# EAGLE design clogic (EAGLE 5.11)

## Sheet 1 of 2
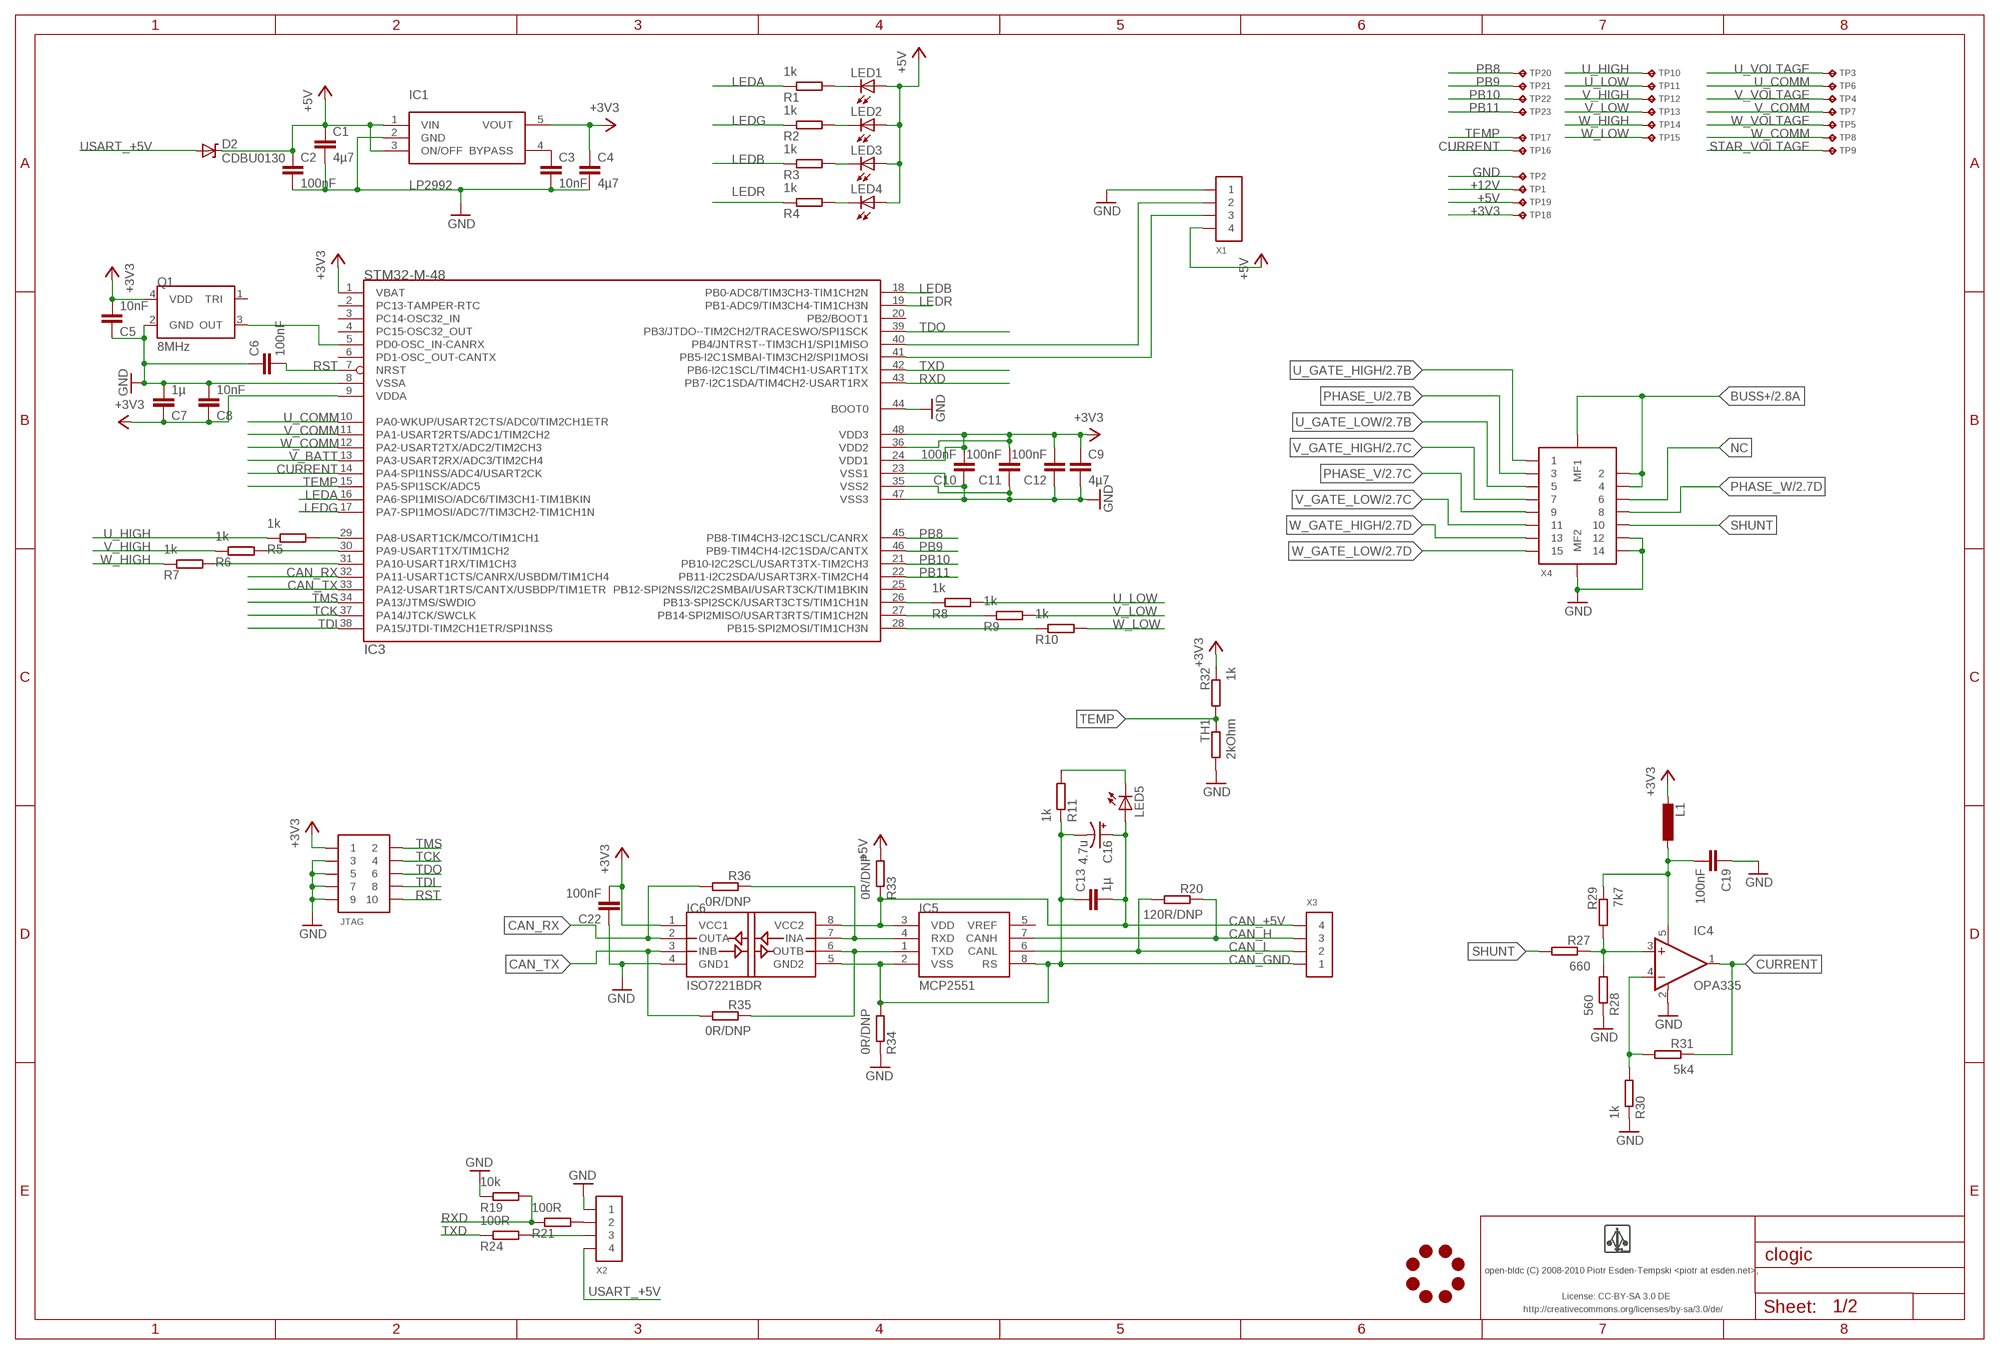
[diagram p0: schematic, sheet 1]

### Parts
C1  4µ7  CAPACITOR-0603  [0603-CAP]
C2  100nF  CAPACITOR-0603  [0603-CAP]
C3  10nF  CAPACITOR-0603  [0603-CAP]
C4  4µ7  CAPACITOR-0603  [0603-CAP]
C5  10nF  CAPACITOR-0603  [0603-CAP]
C6  100nF  CAPACITOR-0603  [0603-CAP]
C7  1µ  CAPACITOR-0603  [0603-CAP]
C8  10nF  CAPACITOR-0603  [0603-CAP]
C9  4µ7  CAPACITOR-0603  [0603-CAP]
C10  100nF  CAPACITOR-0603  [0603-CAP]
C11  100nF  CAPACITOR-0603  [0603-CAP]
C12  100nF  CAPACITOR-0603  [0603-CAP]
C13  1µ  CAPACITOR-0603  [0603-CAP]
C16  4.7u  CPOL-US  [CAP_0805TANT_F95]
C19  100nF  CAPACITOR-0603  [0603-CAP]
C22  100nF  CAPACITOR-0603  [0603-CAP]
D2  CDBU0130  DIODE-ZENER-0603  [0603-LED]
IC1  LP2992  [SOT23-5]
IC3  STM32-M-48  [LQFP48]
IC4  OPA335  [SOT23-5]
IC5  MCP2551  [SO8]
IC6  ISO7221BDR  ISO7221  [SO8]
JL1  JOBY_LOGO-6MIL  [JOBY_LOGO_6MIL]
JTAG  CONN_5-2-FTSH-V  [FTSH-105-DV]
L1  INDUCTOR-0603  [0603-IND]
LED1  AMBER  LED-0603  [0603-LED]
LED2  GREEN  LED-0603  [0603-LED]
LED3  BLUE  LED-0603  [0603-LED]
LED4  RED  LED-0603  [0603-LED]
LED5  WHITE  LED-0603  [0603-LED]
Q1  8MHz  ASE_ASCILLATOR  [ASE_OSCILLATOR]
R1  1k  RESISTOR-0603  [0603-RES]
R2  1k  RESISTOR-0603  [0603-RES]
R3  1k  RESISTOR-0603  [0603-RES]
R4  1k  RESISTOR-0603  [0603-RES]
R5  1k  RESISTOR-0603  [0603-RES]
R6  1k  RESISTOR-0603  [0603-RES]
R7  1k  RESISTOR-0603  [0603-RES]
R8  1k  RESISTOR-0603  [0603-RES]
R9  1k  RESISTOR-0603  [0603-RES]
R10  1k  RESISTOR-0603  [0603-RES]
R11  1k  RESISTOR-0603  [0603-RES]
R19  10k  RESISTOR-0603  [0603-RES]
R20  120R/DNP  RESISTOR-0603  [0603-RES]
R21  100R  RESISTOR-0603  [0603-RES]
R24  100R  RESISTOR-0603  [0603-RES]
R27  660  RESISTOR-0603  [0603-RES]
R28  560  RESISTOR-0603  [0603-RES]
R29  7k7  RESISTOR-0603  [0603-RES]
R30  1k  RESISTOR-0603  [0603-RES]
R31  5k4  RESISTOR-0603  [0603-RES]
R32  1k  RESISTOR-0603  [0603-RES]
R33  0R/DNP  RESISTOR-0603  [0603-RES]
R34  0R/DNP  RESISTOR-0603  [0603-RES]
R35  0R/DNP  RESISTOR-0603  [0603-RES]
R36  0R/DNP  RESISTOR-0603  [0603-RES]
TH1  2kOhm  RESISTOR-0603  [0603-RES]
TP1  TP-09RSMD  [TP09R]
TP2  TP-09RSMD  [TP09R]
TP3  TP-09RSMD  [TP09R]
TP4  TP-09RSMD  [TP09R]
TP5  TP-09RSMD  [TP09R]
TP6  TP-09RSMD  [TP09R]
TP7  TP-09RSMD  [TP09R]
TP8  TP-09RSMD  [TP09R]
TP9  TP-09RSMD  [TP09R]
TP10  TP-09RSMD  [TP09R]
TP11  TP-09RSMD  [TP09R]
TP12  TP-09RSMD  [TP09R]
TP13  TP-09RSMD  [TP09R]
TP14  TP-09RSMD  [TP09R]
TP15  TP-09RSMD  [TP09R]
TP16  TP-09RSMD  [TP09R]
TP17  TP-09RSMD  [TP09R]
TP18  TP-09RSMD  [TP09R]
TP19  TP-09RSMD  [TP09R]
TP20  TP-09RSMD  [TP09R]
TP21  TP-09RSMD  [TP09R]
TP22  TP-09RSMD  [TP09R]
TP23  TP-09RSMD  [TP09R]
U$1  LOGO  LOGO-NORM  [LOGO]
X1  CONN_4-1-53261  [PB-53261-04]
X2  CONN_4-1-53261  [PB-53261-04]
X3  CONN_4-1-53261  [PB-53261-04]
X4  CONN_15-2-2MT-DF9  [DF9-15]

### Nets
+3V3: C4.P$1 C5.P$2 C7.P$1 C8.P$1 C9.P$1 C10.P$2 C11.P$2 C12.P$2 C22.P$2 IC1.5(VOUT) IC3.1(VBAT) IC3.9(VDDA) IC3.24(VDD1) IC3.36(VDD2) IC3.48(VDD3) IC6.1(VCC1) JTAG.1 L1.P$2 Q1.4(VDD) R32.P$1 TP18.P$1
+5V: C1.P$1 C2.P$1 D2.C IC1.1(VIN) IC1.3(ON/OFF) LED1.A LED2.A LED3.A LED4.A R33.P$2 TP19.P$1 X1.4 ; also sheet 2
+12V: TP1.P$1 ; also sheet 2
A: IC3.40(PB4/JNTRST--TIM3CH1/SPI1MISO) X1.2
B: IC3.41(PB5-I2C1SMBAI-TIM3CH2/SPI1MOSI) X1.3
BUSS+: X4.2 X4.4 X4.MF1 ; also sheet 2
CAN_+5V: C13.P$2 C16.P$1(+) IC5.3(VDD) IC6.8(VCC2) LED5.A R33.P$1 X3.4
CAN_GND: C13.P$1 C16.P$2(-) IC5.2(VSS) IC5.8(RS) IC6.5(GND2) R11.P$1 R34.P$2 X3.1
CAN_H: IC5.7(CANH) R20.P$1 X3.3
CAN_L: IC5.6(CANL) R20.P$2 X3.2
CAN_RX: IC3.32(PA11-USART1CTS/CANRX/USBDM/TIM1CH4) IC6.2(OUTA) R36.P$2
CAN_TX: IC3.33(PA12-USART1RTS/CANTX/USBDP/TIM1ETR) IC6.3(INB) R35.P$2
CURRENT: IC3.14(PA4-SPI1NSS/ADC4/USART2CK) IC4.1(OUT) R31.P$1 TP16.P$1
GND: C1.P$2 C2.P$2 C3.P$2 C4.P$2 C5.P$1 C6.P$1 C7.P$2 C8.P$2 C9.P$2 C10.P$1 C11.P$1 C12.P$1 C19.P$1 C22.P$1 IC1.2(GND) IC3.8(VSSA) IC3.23(VSS1) IC3.35(VSS2) IC3.44(BOOT0) IC3.47(VSS3) IC4.2(V-) IC6.4(GND1) JTAG.3 JTAG.5 JTAG.7 JTAG.9 Q1.2(GND) R19.P$1 R28.P$1 R30.P$1 R34.P$1 TH1.P$2 TP2.P$1 X1.1 X2.1 X4.12 X4.14 X4.MF2 ; also sheet 2
LEDA: IC3.16(PA6-SPI1MISO/ADC6/TIM3CH1-TIM1BKIN) R1.P$1
LEDB: IC3.18(PB0-ADC8/TIM3CH3-TIM1CH2N) R3.P$1
LEDG: IC3.17(PA7-SPI1MOSI/ADC7/TIM3CH2-TIM1CH1N) R2.P$1
LEDR: IC3.19(PB1-ADC9/TIM3CH4-TIM1CH3N) R4.P$1
N$1: LED5.C R11.P$2
N$3: LED1.C R1.P$2
N$4: LED4.C R4.P$2
N$5: LED3.C R3.P$2
N$6: R21.P$2 X2.2
N$9: C19.P$2 IC4.5(V+) L1.P$1 R29.P$1
N$10: LED2.C R2.P$2
N$11: IC4.3(+IN) R27.P$1 R28.P$2 R29.P$2
N$12: IC4.4(-IN) R30.P$2 R31.P$2
N$13: IC5.1(TXD) IC6.6(OUTB) R35.P$1
N$14: IC5.4(RXD) IC6.7(INA) R36.P$1
N$20: R24.P$2 X2.3
N$22: C3.P$1 IC1.4(BYPASS)
N$33: IC3.26(PB13-SPI2SCK/USART3CTS/TIM1CH1N) R8.P$1
N$36: IC3.27(PB14-SPI2MISO/USART3RTS/TIM1CH2N) R9.P$1
N$39: IC3.28(PB15-SPI2MOSI/TIM1CH3N) R10.P$1
N$40: IC3.5(PD0-OSC_IN-CANRX) Q1.3(OUT)
N$41: IC3.29(PA8-USART1CK/MCO/TIM1CH1) R5.P$2
N$42: IC3.30(PA9-USART1TX/TIM1CH2) R6.P$2
N$45: IC3.31(PA10-USART1RX/TIM1CH3) R7.P$2
NC: X4.6
PB8: IC3.45(PB8-TIM4CH3-I2C1SCL/CANRX) TP20.P$1
PB9: IC3.46(PB9-TIM4CH4-I2C1SDA/CANTX) TP21.P$1
PB10: IC3.21(PB10-I2C2SCL/USART3TX-TIM2CH3) TP22.P$1
PB11: IC3.22(PB11-I2C2SDA/USART3RX-TIM2CH4) TP23.P$1
PHASE_U: X4.3 ; also sheet 2
PHASE_V: X4.9 ; also sheet 2
PHASE_W: X4.8 ; also sheet 2
RST: C6.P$2 IC3.7(NRST) JTAG.10
RXD: IC3.43(PB7-I2C1SDA/TIM4CH2-USART1RX) R19.P$2 R21.P$1
SHUNT: R27.P$2 X4.10
STAR_VOLTAGE: TP9.P$1 ; also sheet 2
TCK: IC3.37(PA14/JTCK/SWCLK) JTAG.4
TDI: IC3.38(PA15/JTDI-TIM2CH1ETR/SPI1NSS) JTAG.8
TDO: IC3.39(PB3/JTDO--TIM2CH2/TRACESWO/SPI1SCK) JTAG.6
TEMP: IC3.15(PA5-SPI1SCK/ADC5) R32.P$2 TH1.P$1 TP17.P$1
TMS: IC3.34(PA13/JTMS/SWDIO) JTAG.2
TXD: IC3.42(PB6-I2C1SCL/TIM4CH1-USART1TX) R24.P$1
U_COMM: IC3.10(PA0-WKUP/USART2CTS/ADC0/TIM2CH1ETR) TP6.P$1 ; also sheet 2
U_GATE_HIGH: X4.1 ; also sheet 2
U_GATE_LOW: X4.5 ; also sheet 2
U_HIGH: R5.P$1 TP10.P$1 ; also sheet 2
U_LOW: R8.P$2 TP11.P$1 ; also sheet 2
U_VOLTAGE: TP3.P$1 ; also sheet 2
USART_+5V: D2.A X2.4
V_BATT: IC3.13(PA3-USART2RX/ADC3/TIM2CH4) ; also sheet 2
V_COMM: IC3.11(PA1-USART2RTS/ADC1/TIM2CH2) TP7.P$1 ; also sheet 2
V_GATE_HIGH: X4.7 ; also sheet 2
V_GATE_LOW: X4.11 ; also sheet 2
V_HIGH: R6.P$1 TP12.P$1 ; also sheet 2
V_LOW: R9.P$2 TP13.P$1 ; also sheet 2
V_VOLTAGE: TP4.P$1 ; also sheet 2
W_COMM: IC3.12(PA2-USART2TX/ADC2/TIM2CH3) TP8.P$1 ; also sheet 2
W_GATE_HIGH: X4.13 ; also sheet 2
W_GATE_LOW: X4.15 ; also sheet 2
W_HIGH: R7.P$1 TP14.P$1 ; also sheet 2
W_LOW: R10.P$2 TP15.P$1 ; also sheet 2
W_VOLTAGE: TP5.P$1 ; also sheet 2
Unconnected: IC3.2(PC13-TAMPER-RTC) IC3.3(PC14-OSC32_IN) IC3.4(PC15-OSC32_OUT) IC3.6(PD1-OSC_OUT-CANTX) IC3.20(PB2/BOOT1) IC3.25(PB12-SPI2NSS/I2C2SMBAI/USART3CK/TIM1BKIN) IC5.5(VREF) Q1.1(TRI)

### Notes on the sheet
- open-bldc (C) 2008-2010 Piotr Esden-Tempski <piotr at esden.net>,
- License: CC-BY-SA 3.0 DE
- http://creativecommons.org/licenses/by-sa/3.0/de/

## Sheet 2 of 2
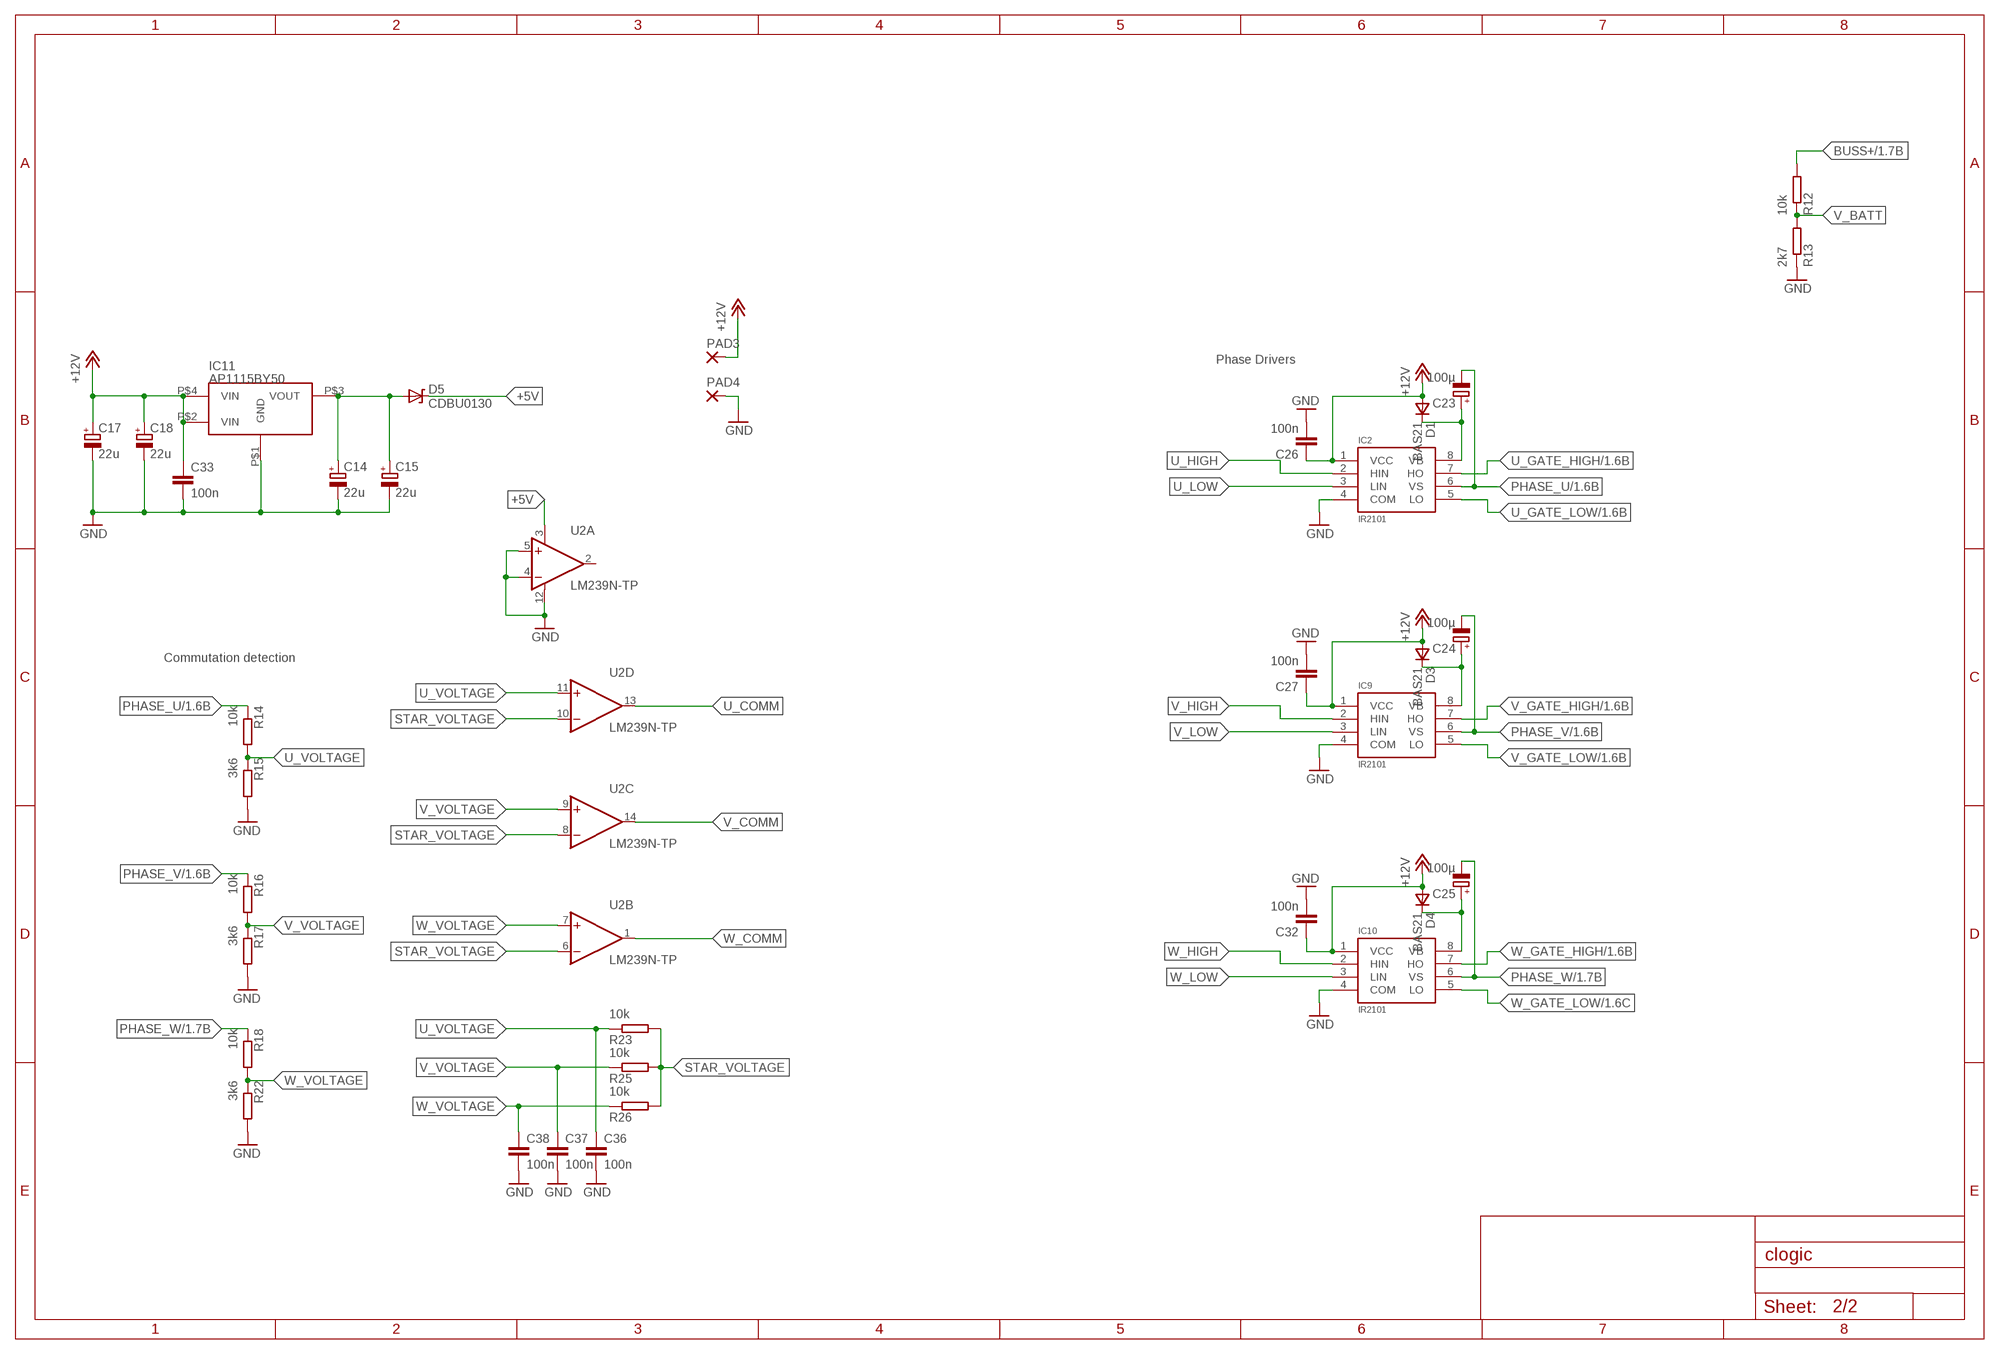
[diagram p1: schematic, sheet 2]

### Parts
C14  22u  CAPACITOR-POL-0805  [0805-POL-CAP]
C15  22u  CAPACITOR-POL-0805  [0805-POL-CAP]
C17  22u  CAPACITOR-POL-0805  [0805-POL-CAP]
C18  22u  CAPACITOR-POL-0805  [0805-POL-CAP]
C23  100µ  CAPACITOR-POL-0805  [0805-POL-CAP]
C24  100µ  CAPACITOR-POL-0805  [0805-POL-CAP]
C25  100µ  CAPACITOR-POL-0805  [0805-POL-CAP]
C26  100n  CAPACITOR-0603  [0603-CAP]
C27  100n  CAPACITOR-0603  [0603-CAP]
C32  100n  CAPACITOR-0603  [0603-CAP]
C33  100n  CAPACITOR-0603  [0603-CAP]
C36  100n  CAPACITOR-0603  [0603-CAP]
C37  100n  CAPACITOR-0603  [0603-CAP]
C38  100n  CAPACITOR-0603  [0603-CAP]
D1  BAS21  VAR2SOT23  [SOT-23]
D3  BAS21  VAR2SOT23  [SOT-23]
D4  BAS21  VAR2SOT23  [SOT-23]
D5  CDBU0130  DIODE-ZENER-0603  [0603-LED]
IC2  IR2101  [SO-8]
IC9  IR2101  [SO-8]
IC10  IR2101  [SO-8]
IC11  AP1115BY50  [SOT89]
PAD3  SMD5  [SMD2,54-5,08]
PAD4  SMD5  [SMD2,54-5,08]
R12  10k  RESISTOR-0603  [0603-RES]
R13  2k7  RESISTOR-0603  [0603-RES]
R14  10k  RESISTOR-0603  [0603-RES]
R15  3k6  RESISTOR-0603  [0603-RES]
R16  10k  RESISTOR-0603  [0603-RES]
R17  3k6  RESISTOR-0603  [0603-RES]
R18  10k  RESISTOR-0603  [0603-RES]
R22  3k6  RESISTOR-0603  [0603-RES]
R23  10k  RESISTOR-0603  [0603-RES]
R25  10k  RESISTOR-0603  [0603-RES]
R26  10k  RESISTOR-0603  [0603-RES]
U2  LM239N-TP  [TSSOP_14]

### Nets
+5V: D5.C U2.3(A:V+) ; also sheet 1
+5VOUT: C14.+ C15.+ D5.A IC11.P$3(VOUT)
+12V: C17.+ C18.+ C26.P$1 C27.P$1 C32.P$1 C33.P$1 D1.3(A) D3.3(A) D4.3(A) IC2.1(VCC) IC9.1(VCC) IC10.1(VCC) IC11.P$2(VIN) IC11.P$4(VIN) PAD3.1(P) ; also sheet 1
BUSS+: R12.P$2 ; also sheet 1
GND: C14.- C15.- C17.- C18.- C26.P$2 C27.P$2 C32.P$2 C33.P$2 C36.P$2 C37.P$2 C38.P$2 IC2.4(COM) IC9.4(COM) IC10.4(COM) IC11.P$1(GND) PAD4.1(P) R13.P$1 R15.P$2 R17.P$2 R22.P$2 U2.4(A:-IN) U2.5(A:+IN) U2.12(A:V-) ; also sheet 1
N$2: C23.+ D1.1(C) IC2.8(VB)
N$7: C24.+ D3.1(C) IC9.8(VB)
N$8: C25.+ D4.1(C) IC10.8(VB)
PHASE_U: C23.- IC2.6(VS) R14.P$1 ; also sheet 1
PHASE_V: C24.- IC9.6(VS) R16.P$1 ; also sheet 1
PHASE_W: C25.- IC10.6(VS) R18.P$1 ; also sheet 1
STAR_VOLTAGE: R23.P$2 R25.P$2 R26.P$2 U2.6(B:-IN) U2.8(C:-IN) U2.10(D:-IN) ; also sheet 1
U_COMM: U2.13(D:OUT) ; also sheet 1
U_GATE_HIGH: IC2.7(HO) ; also sheet 1
U_GATE_LOW: IC2.5(LO) ; also sheet 1
U_HIGH: IC2.2(HIN) ; also sheet 1
U_LOW: IC2.3(LIN) ; also sheet 1
U_VOLTAGE: C36.P$1 R14.P$2 R15.P$1 R23.P$1 U2.11(D:+IN) ; also sheet 1
V_BATT: R12.P$1 R13.P$2 ; also sheet 1
V_COMM: U2.14(C:OUT) ; also sheet 1
V_GATE_HIGH: IC9.7(HO) ; also sheet 1
V_GATE_LOW: IC9.5(LO) ; also sheet 1
V_HIGH: IC9.2(HIN) ; also sheet 1
V_LOW: IC9.3(LIN) ; also sheet 1
V_VOLTAGE: C37.P$1 R16.P$2 R17.P$1 R25.P$1 U2.9(C:+IN) ; also sheet 1
W_COMM: U2.1(B:OUT) ; also sheet 1
W_GATE_HIGH: IC10.7(HO) ; also sheet 1
W_GATE_LOW: IC10.5(LO) ; also sheet 1
W_HIGH: IC10.2(HIN) ; also sheet 1
W_LOW: IC10.3(LIN) ; also sheet 1
W_VOLTAGE: C38.P$1 R18.P$2 R22.P$1 R26.P$1 U2.7(B:+IN) ; also sheet 1
Unconnected: U2.2(A:OUT)

### Notes on the sheet
- Phase Drivers
- Commutation detection

## Library data of the parts
C1-C13 C19 C22 C26 C27 C32 C33 C36-C38 = pel_dipol_comp:CAPACITOR
C14 C15 C17 C18 C23-C25 = pel_dipol_comp:CAPACITOR-POL
C16 = booz_imu_h:CPOL-US: POLARIZED CAPACITOR, American symbol
D1 D3 D4 = zetex:VAR2SOT23: DIODE
D2 D5 = pel_dipol_comp:DIODE-ZENER
IC1 = open-bldc:LP2992
IC2 IC9 IC10 = open-bldc:IR2101
IC3 = pel_stm32:STM32-M-48: STM32F103 Medium Density 48pins
IC4 = open-bldc:OPA335
IC5 = open-bldc:MCP2551
IC6 = open-bldc:ISO7221
IC11 = clogic-v0_3-r1:AP1115BY50
JL1 = open-bldc:JOBY_LOGO
JTAG = pel_misc:CONN_5-2
L1 = res_cap:INDUCTOR
LED1-LED5 = pel_dipol_comp:LED
PAD3 PAD4 = wirepad:SMD5: SMD PAD
Q1 = open-bldc:ASE_ASCILLATOR
R1-R36 TH1 = pel_dipol_comp:RESISTOR
TP1-TP23 = pel_misc:TP
U2 = open-bldc:LM239N
U$1 = open-bldc:LOGO
X1-X3 = pel_molex:CONN_4-1
X4 = open-bldc:CONN_15-2-2MT

## Board
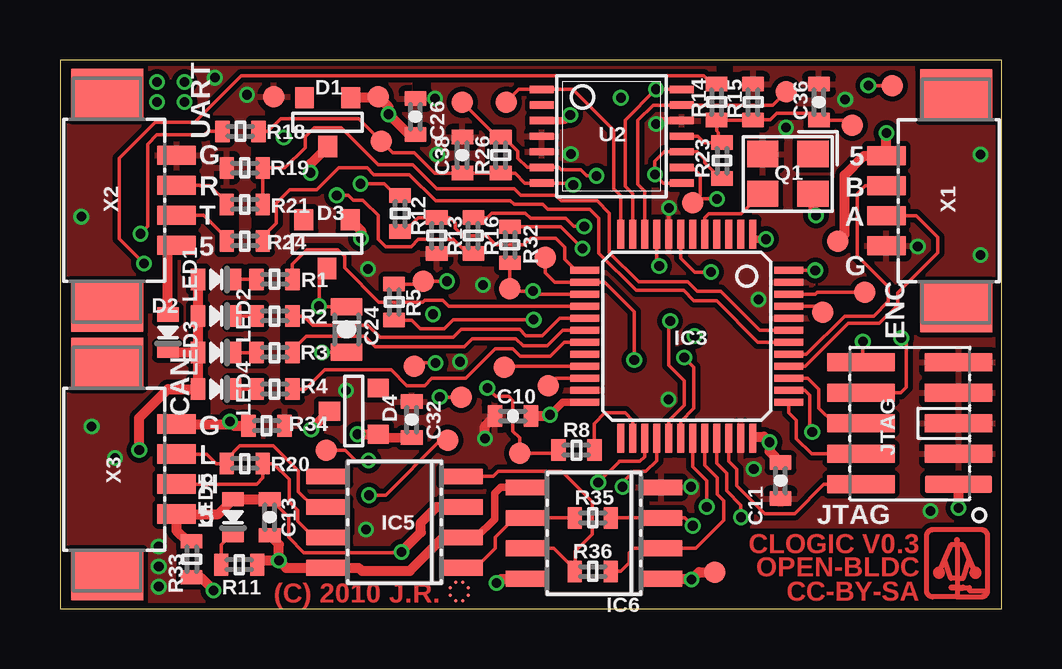
[diagram p2: board, top side]
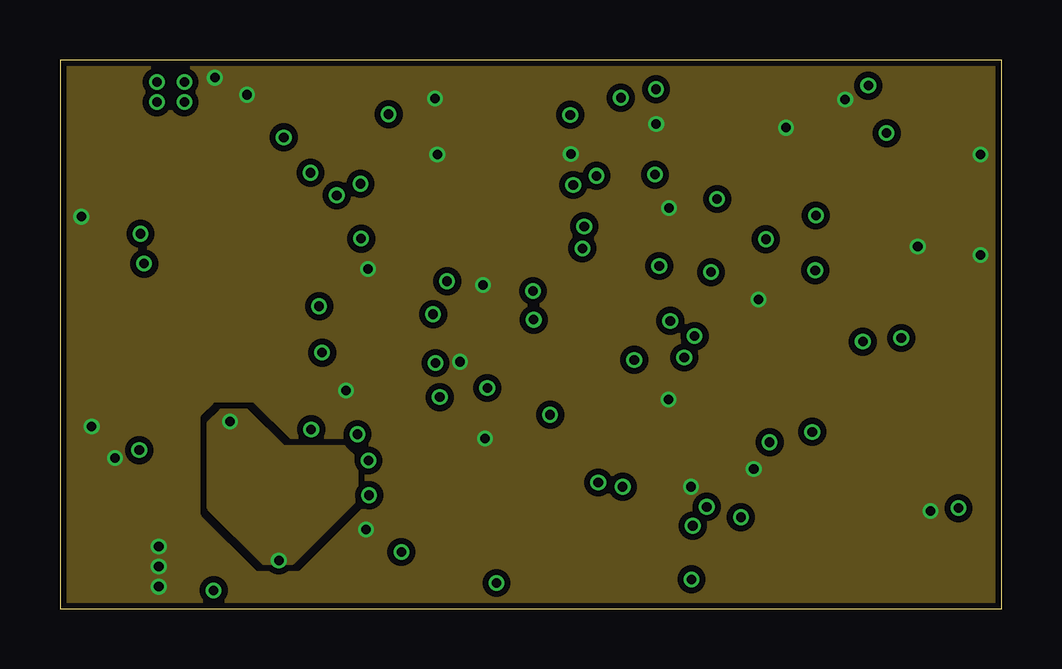
[diagram p3: board, inner layer Route2]
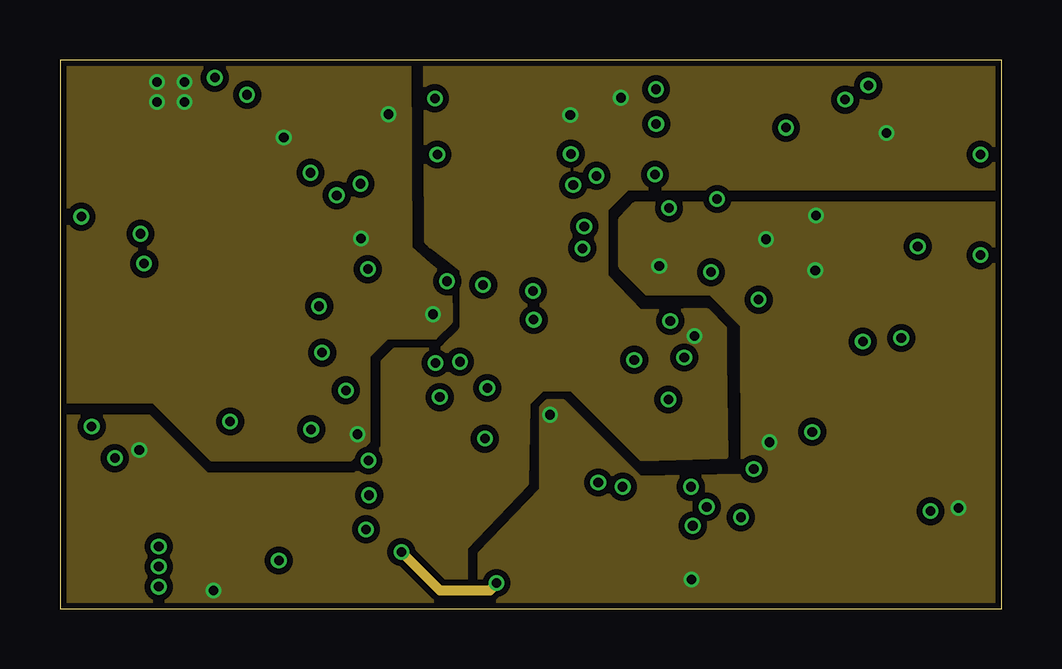
[diagram p4: board, inner layer Route15]
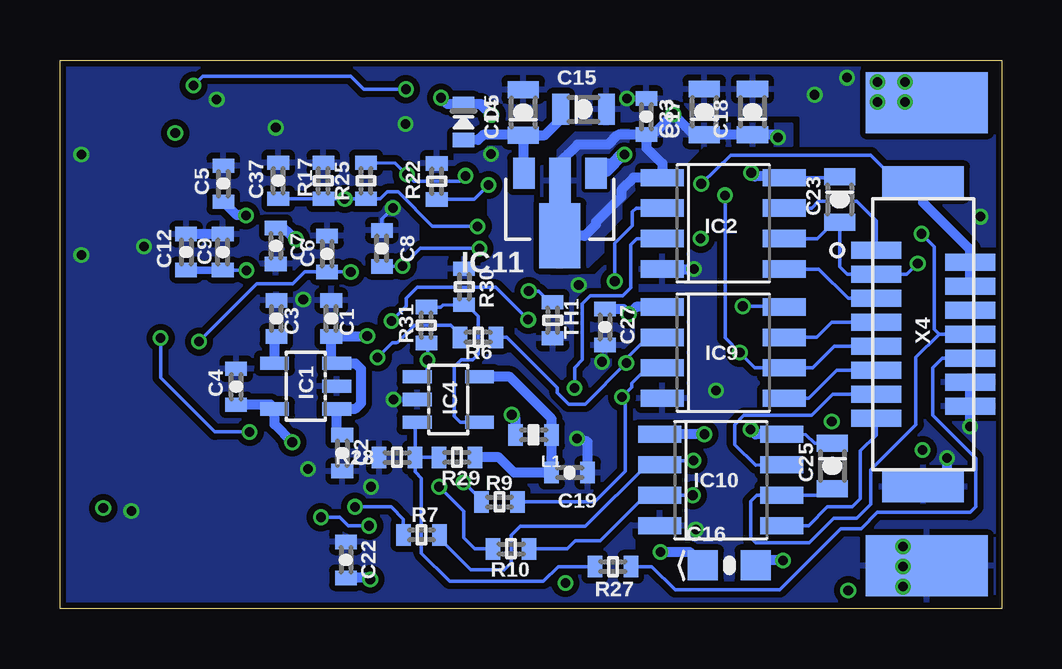
[diagram p5: board, bottom side, seen from below]

Size 39.24 x 22.86 mm. Coordinates in mm from the lower left corner, seen from the top.
Outline: 0,0 39.24,0 39.24,22.86 0,22.86 0,0
Copper layers (1*2+15*16): Top 0.035mm / dielectric 0.75mm / Route2 0.035mm / dielectric 0.15mm / Route15 0.035mm / dielectric 0.75mm / Bottom 0.035mm
Design rules "default *": minimum track width 6mil, minimum drill 15mil, track to track 6mil, track to pad 6mil, pad to pad 6mil, via to via 6mil, smd to smd 6mil, copper to edge 10mil, drill to drill 8mil, minimum pad ring 5mil, minimum via ring 5mil, stop-mask expansion 4mil, vias tented up to drill 0.4mm, thermal gap 10mil
tRestrict: area 27.3,1.6 to 29.8,2; area 32,2.6 to 33.3,3.1; area 11.7,3.2 to 12.1,4.1; area 8.8,6.6 to 11,7.1; area 3.3,12.5 to 4.2,12.8; area 5.7,7.9 to 6.1,8.7; area 9.4,9.4 to 9.7,13.4; area 13.7,19.5 to 14.5,20; area 14.9,21.5 to 15.3,22.1; area 7.1,15.6 to 7.3,16.5; area 8.2,15.6 to 8.4,16.5; area 8.2,18.6 to 8.5,19.5; area 18,0.2 to 18.5,1; area 27.6,22 to 27.8,22.7; area 28.4,18.4 to 28.6,19.5; area 5.2,14 to 5.5,15; area 28.2,21.5 to 28.5,22.1; area 5.1,1.5 to 5.3,2.6; area 17.6,14.5 to 18.4,14.7; area 17.9,18.4 to 18.2,19.4; area 8.7,20.3 to 9,21.1; area 24.2,4.1 to 24.4,4.7
bRestrict: area 20.6,10.9 to 22.5,12.4; area 17.7,2.1 to 19.8,3; area 21.7,15 to 24,17.2; area 13.7,2.1 to 15,3; area 23.6,8.4 to 23.7,9

### Footprints (pad centres in the part's own frame; a part is rotated, then mirrored left to right if it is on the bottom)
0603-CAP = smd 0.6 x 0.9: P$1 -0.75,0; P$2 0.75,0
0805-POL-CAP = smd 0.7 x 1.3: + -0.95,0; - 0.95,0
CAP_0805TANT_F95 = smd 1.25 x 1.25: P$1 -1.1,0; P$2 1.1,0
SOT-23 = smd 0.787 x 0.889: 1 0.025,-1.016; 2 -0.94,1.016; 3 0.991,1.016
0603-LED = smd 0.6 x 0.9: A 0.75,0; C -0.75,0
SOT23-5 = smd 0.55 x 1.2: 1 -0.95,-1.3; 2 0,-1.3; 3 0.95,-1.3; 4 0.95,1.3; 5 -0.95,1.3
SO-8 = smd 0.72 x 1.78: 1 -1.905,-2.543; 2 -0.635,-2.543; 3 0.635,-2.543; 4 1.905,-2.543; 5 1.905,2.543; 6 0.635,2.543; 7 -0.635,2.543; 8 -1.905,2.543
LQFP48 = smd 0.3 x 1.2: 1 -2.75,-4.25; 2 -2.25,-4.25; 3 -1.75,-4.25; 4 -1.25,-4.25; 5 -0.75,-4.25; 6 -0.25,-4.25; 7 0.25,-4.25; 8 0.75,-4.25; 9 1.25,-4.25; 10 1.75,-4.25; 11 2.25,-4.25; 12 2.75,-4.25; 25 2.75,4.25; 26 2.25,4.25; 27 1.75,4.25; 28 1.25,4.25; 29 0.75,4.25; 30 0.25,4.25; 31 -0.25,4.25; 32 -0.75,4.25; 33 -1.25,4.25; 34 -1.75,4.25; 35 -2.25,4.25; 36 -2.75,4.25 | smd 1.2 x 0.3: 13 4.25,-2.75; 14 4.25,-2.25; 15 4.25,-1.75; 16 4.25,-1.25; 17 4.25,-0.75; 18 4.25,-0.25; 19 4.25,0.25; 20 4.25,0.75; 21 4.25,1.25; 22 4.25,1.75; 23 4.25,2.25; 24 4.25,2.75; 37 -4.25,2.75; 38 -4.25,2.25; 39 -4.25,1.75; 40 -4.25,1.25; 41 -4.25,0.75; 42 -4.25,0.25; 43 -4.25,-0.25; 44 -4.25,-0.75; 45 -4.25,-1.25; 46 -4.25,-1.75; 47 -4.25,-2.25; 48 -4.25,-2.75
SO8 = smd 0.65 x 1.75: 1 -1.905,-2.8; 2 -0.635,-2.8; 3 0.635,-2.8; 4 1.905,-2.8; 5 1.905,2.8; 6 0.635,2.8; 7 -0.635,2.8; 8 -1.905,2.8
SOT89 = smd 0.9 x 1.3: P$1 -1.5,0; P$3 1.5,0 | smd 0.9 x 1.9: P$2 0,0.3 | smd 1.7 x 2.7: P$4 0,2.6
JOBY_LOGO_6MIL = smd 0.152 x 0.152: 1 -0.152,0.381; 2 0.152,0.381; 3 0.381,0.152; 4 0.381,-0.152; 5 0.152,-0.381; 6 -0.152,-0.381; 7 -0.381,-0.152; 8 -0.381,0.152
FTSH-105-DV = smd 0.74 x 2.8: 1 -2.54,-2.03; 2 -2.54,2.03; 3 -1.27,-2.03; 4 -1.27,2.03; 5 0,-2.03; 6 0,2.03; 7 1.27,-2.03; 8 1.27,2.03; 9 2.54,-2.03; 10 2.54,2.03
0603-IND = smd 0.6 x 0.9: P$1 -0.75,0; P$2 0.75,0
SMD2,54-5,08 = smd 2.54 x 5.08: 1 0,0
ASE_OSCILLATOR = smd 1.3 x 1.1: 1 -1.05,-0.825; 2 1.05,-0.825; 3 1.05,0.825; 4 -1.05,0.825
0603-RES = smd 0.6 x 0.9: P$1 -0.75,0; P$2 0.75,0
TP09R = smd 0.9 x 0.9: P$1 0,0
TSSOP_14 = smd 0.305 x 0.991: 1 -1.95,-2.918; 2 -1.3,-2.918; 3 -0.65,-2.918; 4 0,-2.918; 5 0.65,-2.918; 6 1.3,-2.918; 7 1.95,-2.918; 8 1.95,2.918; 9 1.3,2.918; 10 0.65,2.918; 11 0,2.918; 12 -0.65,2.918; 13 -1.3,2.918; 14 -1.95,2.918
PB-53261-04 = smd 0.8 x 1.6: 1 -1.875,1.1; 2 -0.625,1.1; 3 0.625,1.1; 4 1.875,1.1 | smd 2.1 x 3: MNT1 -4.425,-1.8; MNT2 4.425,-1.8
DF9-15 = smd 0.7 x 2.08: 1 -3.5,-1.96; 2 -3,1.96; 3 -2.5,-1.96; 4 -2,1.96; 5 -1.5,-1.96; 6 -1,1.96; 7 -0.5,-1.96; 8 0,1.96; 9 0.5,-1.96; 10 1,1.96; 11 1.5,-1.96; 12 2,1.96; 13 2.5,-1.96; 14 3,1.96; 15 3.5,-1.96 | smd 1.3 x 3.4: MF1 -6.35,0; MF2 6.35,0

### Placement (x,y rotation side)
C1  27.94,12.09 90 bottom
C2  27.48,6.48 270 bottom
C3  30.23,12.09 90 bottom
C4  31.9,9.25 90 bottom
C5  32.44,17.7 270 bottom
C6  28.12,14.78 270 bottom
C7  30.25,15.11 270 bottom
C8  25.83,15.01 90 bottom
C9  32.46,14.86 90 bottom
C10  18.87,8.03 0 top
C11  30.02,5.33 90 top
C12  33.99,14.86 270 bottom
C13  8.74,3.81 90 top
C14  19.94,20.68 90 bottom
C15  17.42,20.8 0 bottom
C16  11.35,1.8 0 bottom
C17  12.4,20.7 90 bottom
C18  10.39,20.7 90 bottom
C19  18.01,5.66 180 bottom
C22  27.33,2.03 270 bottom
C23  6.76,17.04 270 bottom
C24  11.94,11.63 270 top
C25  7.06,5.94 270 bottom
C26  14.81,20.5 90 top
C27  16.54,11.73 270 bottom
C32  14.66,7.87 90 top
C33  14.81,20.5 90 bottom
C36  31.62,21.11 90 top
C37  30.15,17.83 90 bottom
C38  16.76,18.9 90 top
D1  11.13,20.27 0 top
D2  4.5,11.51 90 top
D3  11.1,15.19 0 top
D4  12.24,8.26 270 top
D5  22.43,20.27 270 bottom
DRILEGEND  [DRILEGEND]  -1.33,-7.14 0 top  (outside the outline)
IC1  29.01,9.27 90 bottom
IC2  11.61,16.05 270 bottom
IC3  26.11,11.35 180 top
IC4  23.06,8.71 270 bottom
IC5  13.94,3.61 90 top
IC6  22.25,3.15 90 top
IC9  11.61,10.67 270 bottom
IC10  11.71,5.36 270 bottom
IC11  18.41,18.14 180 bottom
JL1  16.64,0.71 0 top
JTAG  35.41,7.72 90 top
L1  19.51,7.24 180 bottom
LED1  6.5,13.72 180 top
LED2  6.5,12.19 180 top
LED3  6.5,10.67 180 top
LED4  6.5,9.14 180 top
LED5  7.21,3.81 90 top
PAD3  3.12,21.08 90 bottom
PAD4  3.12,1.78 90 bottom
Q1  30.33,18.11 180 top
R1  8.94,13.72 180 top
R2  8.94,12.19 180 top
R3  8.94,10.67 180 top
R4  8.94,9.14 180 top
R5  13.92,12.78 270 top
R6  21.82,11.3 180 bottom
R7  24.18,3.07 180 bottom
R8  21.51,6.6 180 top
R9  20.93,4.45 0 bottom
R10  20.45,2.49 0 bottom
R11  7.47,1.83 180 top
R12  14.17,16.46 90 top
R13  15.7,15.54 90 top
R14  27.36,21.11 270 top
R15  28.88,21.11 90 top
R16  17.22,15.54 90 top
R17  28.27,17.83 90 bottom
R18  7.52,19.89 0 top
R19  7.7,18.36 0 top
R20  7.7,6.05 180 top
R21  7.7,16.84 180 top
R22  23.55,17.81 90 bottom
R23  27.58,18.67 270 top
R24  7.7,15.32 180 top
R25  26.49,17.83 90 bottom
R26  18.36,18.9 90 top
R27  16.21,1.75 0 bottom
R28  25.2,6.3 0 bottom
R29  22.71,6.3 180 bottom
R30  22.4,13.41 270 bottom
R31  23.98,11.81 90 bottom
R32  18.75,15.16 270 top
R33  5.49,2.06 270 top
R34  8.61,7.62 180 top
R35  22.2,3.78 0 top
R36  22.2,1.55 0 top
TH1  18.72,12.01 270 bottom
TP1  13.26,21.34 0 top
TP2  8.92,21.34 0 top
TP3  33.02,20.14 0 top
TP4  26.37,16.92 0 top
TP5  13.39,19.48 0 top
TP6  30.25,21.54 0 top
TP7  34.67,21.79 0 top
TP8  18.59,21.11 0 top
TP9  16.76,21.11 0 top
TP10  15.14,13.64 0 top
TP11  19.15,6.48 0 top
TP12  14.76,10.11 0 top
TP13  16.71,8.81 0 top
TP14  11.1,6.6 0 top
TP15  16.15,7.01 0 top
TP16  20.22,14.63 0 top
TP17  18.75,13.34 0 top
TP18  27.28,1.52 0 top
TP19  32.41,15.32 0 top
TP20  31.78,12.34 0 top
TP21  33.53,13.18 0 top
TP22  18.52,10.06 0 top
TP23  20.35,9.3 0 top
U2  22.99,19.68 270 top
U$1  37.36,1.78 0 top
X1  35.53,16.99 90 top
X2  3.76,17.02 270 top
X3  3.76,5.82 270 top
X4  3.28,11.43 270 bottom

### Tracks (layer width: path | path; a pad name or v marks a point on that pad's centre or on a via)
+3V3  (via drill 0.4, 0.4 pad 0.65)
  Top 0.152: IC3.9 24.86,14.37 v24.97,14.28 | IC3.48 v31.47,14.1 | Q1.4 31.47,17.19 31.47,16.81 | 28.96,7.16 28.9,7.1 IC3.36 | R32.P$1 20.86,15.91 v21.77,15.01
  Top 0.305: v20.42,8.08 20.95,8.6 21.53,8.6 IC3.24 | v29.41,15.39 28.92,15.39 28.87,15.43 IC3.1
  Top 0.406: JTAG.1 v37.44,4.19 | C10.P$2 20.37,8.03 v20.42,8.08 | C11.P$2 29.57,6.55 v29.57,6.93 29.34,7.16 28.96,7.16 | TP18.P$1 26.62,1.52 v26.31,1.22 26.29,1.25 IC6.1 | Q1.4 31.38,16.5 v31.5,16.38
  Bottom 0.152: C8.P$1 v24.98,14.26 v24.97,14.28 24.23,15.01 v21.77,15.01 | C9.P$1 32.45,14.1 v31.47,14.1
  Bottom 0.305: C9.P$1 C12.P$2
  Bottom 0.406: v29.57,6.93 30.3,7.68 IC1.5 30.48,8.5 C4.P$1 | C7.P$1 29.93,15.86 v29.41,15.39 | v31.5,16.38 31.88,16.39 C5.P$2 | C22.P$2 26.38,1.28 v26.31,1.22 | L1.P$2 20.26,7.91 v20.42,8.08
  pour Route15 (isolate 0.254, rank 6): 17.53,0 17.5,2.29 20.07,4.95 20.07,8.38 20.32,8.64 20.95,8.64 24.13,5.46 28.47,5.54 28.47,6.15 28.45,11.81 27.13,13.13 24.46,13.13 23.37,14.25 23.37,16.23 23.75,16.61 23.98,16.87 39.24,16.89 39.24,0
+5V  (via drill 0.4 pad 0.65)
  Top 0.305: U2.3 20.94,20.34 21.03,20.34 v21.26,20.57
  Top 0.406: LED3.A LED4.A 4.5,9.14 3.3,7.95 v3.3,6.6 | LED3.A LED2.A LED1.A | v34.44,19.81 v34.44,19.8 X1.4 33.5,18.87 32.69,18.06 32.69,15.6 TP19.P$1 | LED3.A | R33.P$2 5.86,1.31 v6.4,0.76 | D2.C 4.58,10.67 LED3.A
  Bottom 0.152: IC1.3
  Bottom 0.406: v26.44,11.35 26.45,11.34 C1.P$1 27.94,10.45 IC1.3 | IC1.3 26.92,10.21 26.7,9.98 26.7,8.56 26.92,8.33 27.7,8.33 IC1.1 27.71,7.45 C2.P$1 | v23.37,21.29 23.1,21.02 D5.C 21.7,21.02 v21.26,20.57
  pour Route15 (isolate 0.254, rank 6): 16.89,0 0,0 0,8 3.68,8 6.1,5.59 12.32,5.59 13.46,6.73 13.46,10.29 13.97,10.79 15.88,10.79 16.76,11.68 16.76,14.1 16.13,14.61 15.44,15.11 15.29,15.27 15.24,22.86 39.24,22.86 39.24,17.53 23.62,17.53 22.73,16.64 22.73,13.84 24.13,12.4 26.92,12.45 27.69,11.68 27.69,10.39 27.74,6.32 24.26,6.22 21.34,9.14 20.07,9.14 19.48,8.56 19.48,8.46 19.43,5.21 16.89,2.54
+5VOUT
  Bottom 0.406: IC11.P$3 19.94,18.14 C14.+ | C14.+ 19.04,19.73 18.37,20.39 C15.+ | C14.+ 21.61,19.74 21.83,19.53 D5.A
+12V  (via drill 0.4, 0.4 pad 0.65)
  Top 0.406: D3.3 12.55,15.75 v12.55,15.42 | D1.3 13.21,21.29 TP1.P$1 13.69,20.9 v13.69,20.6 14.54,19.75 C33.P$1 | C32.P$1 13.4,7.14 D4.3 v12.39,7.26
  Bottom 0.152: PAD3.1 3.15,21.11 v4.04,21.11
  Bottom 0.406: v12.39,7.26 IC10.1 | IC9.1 15.24,12.57 v15.54,12.27 15.76,12.48 C27.P$1 | v9.32,19.63 9.44,19.75 C18.+ C17.+ 12.84,19.75 v13.69,20.6 14.54,19.75 C33.P$1 | C33.P$1 14.81,19.2 14.15,18.54 IC2.1 15.34,17.96 15.85,17.45 15.85,17.17 16.92,16.1 16.92,16 17.38,15.54 IC11.P$4 | IC11.P$2 18.41,18.59 17.68,19.33 16.41,19.33 16,19.74 14.82,19.74 C33.P$1
  other vias: 4.04,21.95 5.18,21.95 5.18,21.11
  pour Route15 (isolate 0.254): 0,22.86 14.53,22.86 14.58,15.04 15.37,14.33 15.85,13.94 16.23,13.56 16.26,11.94 15.62,11.3 13.59,11.3 12.83,10.54 12.83,6.99 12.06,6.22 6.35,6.22 3.94,8.64 0,8.64
  pour Bottom: 8.76,19.3 12.45,19.3 13.34,18.41 13.34,17.65 15.11,17.65 15.88,16.89 15.88,16.26 16.64,15.49 16.64,14.86 17.27,14.22 19.18,14.22 19.18,18.41 18.03,19.56 17.91,19.68 17.78,19.81 16,19.81 15.88,19.94 14.61,19.94 13.97,20.57 13.46,20.57 13.08,20.19 8.76,20.19
A
  Top 0.152: X1.2 35.68,16.37 36.58,15.47 36.58,14.83 34.9,13.16 34.9,12.65 34.14,11.89 32.84,11.89 31.06,10.1 IC3.40
B
  Top 0.152: 34.42,17.6 X1.3 33.54,17.62 33.22,17.3 33.22,14.71 34.52,13.41 34.52,12.8 33.91,12.19 32.69,12.19 31.09,10.59 30.37,10.59 IC3.41
BUSS+  (via drill 0.4 pad 0.65)
  Top 0.152: R12.P$2 14.01,17.21 13.99,17.22 13.5,17.7 v12.52,17.7
  Bottom 0.152: X4.MF1 4.34,17.78 5.46,18.9 11.3,18.9 v12.52,17.7
  Bottom 0.406: X4.MF1 3.28,16.92 1.32,14.96 X4.2 X4.4
CAN_+5V  (via drill 0.4 pad 0.65)
  Top 0.152: C13.P$2 8.78,4.56 9.53,3.81 9.53,2.97 10.16,2.34 14.05,2.34 v14.22,2.36
  Top 0.406: v14.22,2.36 15.04,3.17 15.04,3.58 15.7,4.24 IC5.3 | R33.P$1 5.28,2.82 4.85,3.25 4.85,3.26 X3.4 6.59,3.94 LED5.A C13.P$2 | v18.19,1.07 18.39,1.25 IC6.8
  Route15 0.406: v14.22,2.36 15.82,0.76 17.91,0.76 v18.19,1.07
  Bottom 0.406: v14.22,2.36 13.01,2.36 C16.P$1
CAN_GND  (via drill 0.4 pad 0.65)
  Top 0.305: IC6.5 18.36,5.05 18.11,4.8 18.11,3.73 17.35,2.97 IC5.2
  Top 0.406: R34.P$2 7.26,7.62 v7.09,7.8 6.98,7.69 X3.1 | IC5.2 15.98,2.97 14.58,1.57 12.57,1.57 12.45,1.7 IC5.8 9.42,1.7 v9.12,2.01 | R11.P$1 8.39,2.01 v9.12,2.01 | C13.P$1 9.12,2.68 v9.12,2.01
  Bottom 0.406: C16.P$2 10.15,2.01 v9.12,2.01
  pour Route2 (isolate 0.254): 12.32,4.57 9.65,1.91 8.51,1.91 6.22,4.19 6.22,7.75 6.73,8.26 7.75,8.26 9.27,6.73 11.81,6.73 12.32,6.22
CAN_H
  Top 0.152: X3.3 8.19,5.19 8.46,5.46 8.46,6.03 R20.P$1 8.89,6.04 9.55,5.38 9.55,4.45 9.91,4.09 9.91,3.63 10.57,2.97 IC5.7
CAN_L
  Top 0.152: X3.2 4.88,6.43 6.12,6.43 6.5,6.04 R20.P$2 6.95,6.24 7.49,6.78 8.89,6.78 9.93,5.74 9.93,4.88 10.57,4.24 IC5.6
CAN_RX
  Top 0.152: IC3.32 26.86,5.98 27.38,5.46 27.38,4.78 27.66,4.5 27.66,3.68 26.49,2.52 IC6.2 23.9,2.52 23.72,2.34 23.72,1.91 23.37,1.55 R36.P$2
CAN_TX  (via drill 0.4 pad 0.65)
  Top 0.152: IC3.33 27.36,6.07 27.79,5.64 27.79,4.9 28.37,4.32 v28.37,3.81 | v26.36,3.45 26.04,3.79 IC6.3 R35.P$2
  Bottom 0.152: v28.37,3.81 27.58,3.81 27.23,3.45 v26.36,3.45
CURRENT  (via drill 0.4 pad 0.65)
  Top 0.152: v23.93,10.36 23.93,12.37 22.69,13.6 IC3.14 20.61,13.6 20.22,13.99 TP16.P$1
  Bottom 0.152: R31.P$1 23.93,11 v23.93,10.36 23.93,9.8 24.05,9.68 24.07,9.66 IC4.1
GND  (via drill 0.4 pad 0.65)
  Top 0.152: v25.38,16.69 25.38,15.62 IC3.8 | R34.P$1 9.44,7.68
  Top 0.305: U2.12 24.98,20.34 v24.84,20.19
  Top 0.406: C10.P$1 17.7,7.59 v17.7,7.09
  Bottom 0.152: R28.P$1 25.9,6.44 | C8.P$2 25.83,16.23 v25.38,16.69 | 16.89,18.21 16.89,18.16 IC11.P$1
  Bottom 0.406: X4.12 X4.14 v1.32,7.6 v1.32,7.59 | v2.29,6.27 2.29,5.33 2.52,5.11 2.54,5.11 2.56,5.08 X4.MF2 | C9.P$2 C12.P$1 | R30.P$1 22.39,14.15 | IC2.4 v12.83,14.15 | C19.P$1 17.26,6.95 v17.7,7.09 | 16.43,18.21 v15.72,18.92 15.88,18.92 16.23,18.57 16.74,18.57 16.89,18.41 16.89,18.21 16.43,18.21
  other vias: 4.11,1.75 4.11,2.59 4.11,0.91 7.8,21.41 12.75,3.3 17.63,13.49 15.62,21.26 16.66,10.29 28.91,5.82 29.11,12.88 6.45,22.12 0.89,16.33 36.27,4.06 30.25,20.04 11.91,9.09 32.72,21.21 25.35,8.71 35.74,15.09 38.35,18.92 38.35,14.73 26.29,5.08 21.29,18.95
  pour Top (isolate 0.203, rank 6): 0,0 0,22.86 39.24,22.86 39.24,0
  pour Bottom (isolate 0.254, rank 6): 0,0 0,22.86 39.24,22.86 39.24,0
  pour Route2 (isolate 0.254, rank 2): 0,0 0,22.86 39.24,22.86 39.24,0
LEDA
  Top 0.152: R1.P$1 9.68,13.72 9.68,14.35 10.29,14.96 11.58,14.96 11.86,14.68 11.86,14.2 13.28,12.78 15.11,12.78 15.19,12.85 15.95,12.85 16.2,12.6 IC3.16
LEDB
  Top 0.152: R3.P$1 9.7,10.79 10.27,11.36 10.71,11.35 12.7,11.35 13.13,10.92 16.84,10.92 17.17,11.25 19,11.25 19.3,10.95 20.3,10.95 20.95,11.6 IC3.18
LEDG
  Top 0.152: 9.63,12.19 R2.P$1 10.16,12.19 10.54,11.81 12.83,11.81 13.34,11.3 16.38,11.3 16.71,11.63 19.15,11.63 19.41,11.38 20.09,11.38 20.82,12.1 IC3.17
LEDR
  Top 0.152: IC3.19 21.01,11.1 20.42,10.52 19.18,10.52 18.87,10.82 18.14,10.82 16.92,9.6 15.49,9.6 15.19,9.3 14.45,9.3 13.79,9.96 11.02,9.96 10.21,9.14 R4.P$1
N$1
  Top 0.152: LED5.C 7.11,3.05 6.72,2.65 R11.P$2
N$2  (via drill 0.4 pad 0.65)
  Top 0.406: D1.1 10.44,18.54 v10.44,18.16
  Bottom 0.152: IC2.8 6.79,17.96 C23.+
  Bottom 0.406: IC2.8 9.12,18.01 10.29,18.01 v10.44,18.16
N$3
  Top 0.152: LED1.C R1.P$2
N$4
  Top 0.152: LED4.C R4.P$2
N$5
  Top 0.152: LED3.C R3.P$2
N$6
  Top 0.152: X2.2 5.81,17.64 5.84,17.63 6.25,17.63 6.95,16.93 R21.P$2
N$7  (via drill 0.4 pad 0.65)
  Top 0.152: C24.+ 10.86,12.58 v10.79,12.6 10.79,13.84 D3.1
  Bottom 0.152: IC9.8 9.09,12.6 v10.79,12.6
N$8  (via drill 0.4 pad 0.65)
  Top 0.406: v10.46,7.47 D4.1
  Bottom 0.152: C25.+ 7.8,6.88 8.16,7.25 IC10.8
  Bottom 0.406: IC10.8 10.26,7.26 v10.46,7.47
N$9
  Bottom 0.406: R29.P$1 20.95,6.3 20.32,5.66 C19.P$2 L1.P$1 18.76,7.91 20.5,9.65 IC4.5
N$10
  Top 0.152: LED2.C R2.P$2
N$11
  Bottom 0.152: R27.P$1 18.49,1.75 19.1,1.14 23.01,1.14 24.18,2.31 24.18,5.44 24.45,5.7 R28.P$2 | R28.P$2 R29.P$2 | R28.P$2 24.45,7.68 IC4.3
N$12
  Bottom 0.152: R31.P$2 23.38,12.56 23.29,12.65 R30.P$2 22.39,12.65 22.28,12.65 21.82,12.19 21.82,10.59 22.05,10.36 22.53,10.36 22.82,10.07 22.82,8.01 22.57,7.76 22.5,7.76 IC4.4
N$13
  Top 0.152: R35.P$1 IC6.6 18.95,3.79 18.14,2.97 18.14,2.52 17.32,1.7 IC5.1
N$14
  Top 0.152: IC6.7 20.57,2.52 21.44,1.65 R36.P$1 21.46,1.56 21.46,2.39 22.17,3.1 22.17,4.45 20.9,5.71 18.26,5.71 18.06,5.51 IC5.4
N$20
  Top 0.152: X2.3 6,16.39 6.63,15.75 6.95,15.43 R24.P$2
N$22
  Bottom 0.406: C3.P$1 30.31,11.26 IC1.4
N$33
  Top 0.152: IC3.26 23.86,7.84 23.55,8.15 22.71,8.15 22.26,7.71 R8.P$1
N$36  (via drill 0.4 pad 0.65)
  Top 0.152: IC3.27 24.36,6.33 24.16,6.13 23.3,6.13 v22.43,5.26
  Bottom 0.152: R9.P$1 21.61,4.45 v22.43,5.26
N$39  (via drill 0.4 pad 0.65)
  Top 0.152: v23.44,5.08 23.44,5.26 23.9,5.71 24.41,5.71 24.86,6.17 IC3.28
  Bottom 0.152: R10.P$1 21.97,2.49 22.43,2.95 22.43,4.06 v23.44,5.08
N$40
  Top 0.152: Q1.3 29.18,17.27 28.38,16.46 27.03,16.46 26.86,16.3 IC3.5
N$41  (via drill 0.4 pad 0.65)
  Top 0.152: v19.74,12.04 16.38,12.04 16,11.66 15.01,11.66 14.66,12.01 R5.P$2 | IC3.29 25.36,7.83 26.01,8.48 26.01,9.5 25.38,10.13 25.38,11.94 v25.43,11.99
  Bottom 0.152: v19.74,12.04 21.08,13.39 24.36,13.39 24.82,12.93 24.82,12.6 v25.43,11.99
N$42  (via drill 0.4 pad 0.65)
  Top 0.152: IC3.30 25.86,7.79 26.42,8.36 26.42,10.06 v26.01,10.46
  Bottom 0.152: R6.P$2 22.57,11.42 22.96,11.81 24.46,11.81 25.17,11.1 25.22,11.07 25.4,11.07 v26.01,10.46
N$45  (via drill 0.4 pad 0.65)
  Top 0.152: IC3.31 26.36,6.37 26.36,5.92 26.95,5.33 v26.95,4.24
  Bottom 0.152: R7.P$2 24.93,3.72 25.44,4.24 26.38,4.24 v26.95,4.24
PB8
  Top 0.152: IC3.45 31.52,12.6 TP20.P$1
PB9
  Top 0.152: IC3.46 31.47,13.1 31.55,13.18 TP21.P$1
PB10
  Top 0.152: IC3.21 18.56,10.1 TP22.P$1
PB11
  Top 0.152: IC3.22 20.65,9.6 TP23.P$1
PHASE_U  (via drill 0.4 pad 0.65)
  Top 0.152: R14.P$1 27.16,21.86 26.82,22.2 7.54,22.2 5.61,20.27 3.96,20.27 2.46,18.77 2.46,15.42 v3.5,14.38
  Bottom 0.152: IC2.6 7.7,15.42 7.02,16.09 C23.- 6.76,14.25 6.44,13.93 X4.3 3.95,13.93 v3.5,14.38
PHASE_V  (via drill 0.4 pad 0.65)
  Top 0.152: v11.53,17.22 12.01,17.22 12.22,17.02 12.62,17.02 12.7,16.94 13.26,16.38 13.26,15.39 13.56,15.09 14.63,15.09 14.94,15.39 16.38,15.39 16.98,14.79 R16.P$1 | C24.- 10.96,10.68 v10.92,10.67
  Bottom 0.152: X4.9 6.98,10.93 7.87,10.03 IC9.6 10.29,10.03 v10.92,10.67 11.53,11.28 v11.53,17.22
PHASE_W  (via drill 0.4 pad 0.65)
  Top 0.152: v3.35,15.62 3.66,15.93 3.66,19.36 4.04,19.74 6.02,19.74 6.17,19.89 R18.P$1
  Bottom 0.152: 2.62,11.43 X4.8 | 2.62,11.43 3.58,10.46 3.58,7.67 5.46,5.79 5.46,4.34 6.04,3.76 7.01,3.76 8.03,2.74 10.26,2.74 10.46,2.95 10.46,4.47 10.21,4.72 IC10.6 7.33,4.72 C25.- | 2.62,11.43 2.82,11.63 2.82,15.09 v3.35,15.62
RST  (via drill 0.4 pad 0.65)
  Top 0.152: IC3.7 25.86,14.6 26.44,14.02 v27.13,14.02 | JTAG.10 33.45,10.34 v33.45,11.12
  Bottom 0.152: v27.13,14.02 27.14,14.03 C6.P$2 29.05,14.03 29.23,13.84 29.54,13.54 31.04,13.54 v33.45,11.12
RXD
  Top 0.152: R21.P$1 R19.P$2 9.37,18.36 10.21,19.2 10.21,19.66 10.59,20.04 11.71,20.04 13.26,18.49 14.71,18.49 15.7,17.5 18.92,17.5 19.2,17.22 20.67,17.22 20.89,16.99 22.38,16.99 22.89,16.48 22.89,14.83 24.11,13.61 26.16,13.61 26.54,13.23 27.53,13.23 29.16,11.6 IC3.43
SHUNT
  Bottom 0.152: X4.10 2.47,10.43 2.87,10.03 2.87,8.05 1.09,6.27 1.09,4.24 1.32,4.01 5.18,4.01 5.87,3.33 6.71,3.33 9.25,0.79 13.61,0.79 14.58,1.75 R27.P$2
STAR_VOLTAGE  (via drill 0.4 pad 0.65)
  Top 0.152: v22.35,18.03 21.95,18.03 21.69,18.29 20.88,18.29 20.77,18.39 U2.6 19.46,18.39 19.07,18.77 19.07,19.05 18.48,19.65 R26.P$2 18.22,19.65 TP9.P$1 | U2.8 25.14,17.73 v24.79,18.09 24.79,18.64 25.18,19.04 U2.10 26.55,19.04 26.55,19.03 26.86,18.72 26.86,18.58 27.52,17.92 R23.P$2
  Bottom 0.152: R25.P$2 26.43,18.58 25.27,18.57 v24.79,18.09 24.51,17.8 22.58,17.8 v22.35,18.03
TCK
  Top 0.152: JTAG.4 31.32,6.45 30.68,7.09 30.68,7.85 30.36,8.17 IC3.37
TDI  (via drill 0.4 pad 0.65)
  Top 0.152: v35.05,11.28 35.26,11.07 35.26,9.22 35.03,8.99 JTAG.8 | IC3.38 31.03,9.1 31.24,8.89 31.24,7.47 v31.34,7.37
  Bottom 0.152: v35.05,11.28 35.05,9.63 32.79,7.37 v31.34,7.37
TDO
  Top 0.152: IC3.39 31.16,9.6 31.62,9.14 31.62,8.36 32.26,7.72 JTAG.6
TEMP  (via drill 0.4 pad 0.65)
  Top 0.152: TP17.P$1 18.75,13.41 | TP17.P$1 18.85,13.23 v19.71,13.23 19.84,13.11 20.09,13.1 IC3.15 | TP17.P$1 R32.P$2
  Bottom 0.152: TH1.P$1 18.85,12.78 19.29,13.22 v19.71,13.23
TMS
  Top 0.152: IC3.34 27.86,6.15 28.19,5.82 28.19,5.13 29.36,3.96 30.61,3.96 31.83,5.18 JTAG.2
TXD
  Top 0.152: R24.P$1 8.46,15.49 9.02,16.05 9.02,16.89 9.58,17.45 10.69,17.45 11.61,18.36 12.8,18.36 13.08,18.09 14.55,18.09 15.65,16.99 18.77,16.99 18.92,16.84 20.11,16.84 20.32,16.64 22.07,16.64 22.45,16.26 22.45,14.81 24,13.26 25.98,13.26 26.42,12.83 27.36,12.83 29.08,11.1 IC3.42
U_COMM
  Top 0.152: IC3.10 24.36,17.4 24.08,17.68 24.08,20.34 24.72,20.98 U2.13 29.7,20.98 TP6.P$1
U_GATE_HIGH
  Bottom 0.152: X4.1 5.24,16.16 6.04,16.97 7.64,16.97 7.92,16.69 IC2.7
U_GATE_LOW
  Bottom 0.152: X4.5 6.4,12.93 7.62,14.15 IC2.5
U_HIGH  (via drill 0.4 pad 0.65)
  Top 0.152: v16.13,13.64 TP10.P$1 15.03,13.53 R5.P$1
  Bottom 0.152: IC2.2 15.24,16.69 15.39,16.54 15.39,15.95 16.13,15.21 v16.13,13.64
U_LOW  (via drill 0.4 pad 0.65)
  Top 0.152: v17.8,9.2 18.16,8.84 18.69,8.84 18.87,8.66 18.87,7.39 19.15,7.11 TP11.P$1 20.64,6.48 R8.P$2
  Bottom 0.152: IC2.3 15.21,15.42 15.47,15.16 15.47,13.36 15.8,13.03 17.14,13.03 17.48,12.7 17.48,10.36 17.8,10.03 v17.8,9.2
U_VOLTAGE
  Top 0.152: TP3.P$1 32.75,20.36 C36.P$1 31.33,20.65 29.87,20.65 29.59,20.37 28.91,20.37 R15.P$1 R14.P$2 27.36,19.91 27.43,19.84 27.43,19.57 R23.P$1 26.85,19.42 26.58,19.68 U2.11
USART_+5V
  Top 0.406: X2.4 4.5,15.14 D2.A
V_BATT
  Top 0.152: R12.P$1 14.35,15.72 14.92,16.3 R13.P$2 16.16,16.3 16.25,16.29 16.46,16.08 16.46,15.85 16.76,15.54 17.78,15.54 18.16,15.16 19.33,15.16 19.61,15.44 20.65,15.44 21.03,15.06 21.03,14.55 21.48,14.1 IC3.13
V_COMM  (via drill 0.4 pad 0.65)
  Top 0.152: v33.68,21.79 TP7.P$1 | IC3.11 23.86,17.29 23.55,17.6 23.55,20.35 v24.83,21.64 U2.14
  Bottom 0.152: v24.83,21.64 26.59,21.64 27.13,22.17 33.3,22.17 v33.68,21.79
V_GATE_HIGH
  Bottom 0.152: X4.7 7.09,11.93 7.72,11.3 IC9.7
V_GATE_LOW
  Bottom 0.152: X4.11 6.88,9.93 8.05,8.76 IC9.5
V_HIGH  (via drill 0.4 pad 0.65)
  Top 0.152: TP12.P$1 14.83,10.24 v15.65,10.24
  Bottom 0.152: IC9.2 14.76,11.3 15.65,10.41 v15.65,10.24 17.36,8.52 18.05,8.52 18.52,8.99 18.52,9.2 20.62,11.3 R6.P$1
V_LOW  (via drill 0.4 pad 0.65)
  Top 0.152: v15.82,8.81 TP13.P$1
  Bottom 0.152: R9.P$2 16.97,4.45 15.7,5.71 15.7,8.69 v15.82,8.81 15.8,8.84 15.42,9.22 15.42,9.4 14.78,10.03 IC9.3
V_VOLTAGE  (via drill 0.4 pad 0.65)
  Top 0.152: U2.9 26.34,18.39 26.67,18.06 26.67,17.22 TP4.P$1 26.52,17.07 v27.38,17.07 | R16.P$2 17.8,16.29 18,16.48 18.17,16.48 19.38,16.48 19.61,16.26 21.08,16.26 21.41,15.93 v21.84,15.93
  Bottom 0.152: C37.P$1 R17.P$1 28.35,17.22 28.19,17.07 v27.38,17.07 v27.37,17.08 R25.P$1 25.91,17.07 25.62,17.36 25.16,17.36 23.72,15.93 v21.84,15.93
W_COMM
  Top 0.152: TP8.P$1 19.12,21.64 U2.1 20.63,21.64 21.36,21.64 23.06,19.94 23.06,17.5 23.36,17.2 IC3.12
W_GATE_HIGH
  Bottom 0.152: X4.13 7.05,8.93 7.92,8.05 10.74,8.05 11.12,7.67 11.12,6.83 10.26,5.97 IC10.7
W_GATE_LOW
  Bottom 0.152: X4.15 5.24,7.24 5.89,6.58 5.89,4.57 6.22,4.24 7.26,4.24 8.05,3.45 IC10.5
W_HIGH  (via drill 0.4 pad 0.65)
  Top 0.152: TP14.P$1 11.89,6.6 12.32,6.17 v12.85,6.17
  Bottom 0.152: R7.P$1 23.42,2.92 22.12,1.63 20.73,1.63 20.45,1.91 20.45,3.05 20.07,3.43 17.35,3.43 14.78,5.99 IC10.2 13.74,5.99 13.56,6.17 v12.85,6.17
W_LOW  (via drill 0.4 pad 0.65)
  Top 0.152: v12.88,4.72 13.56,4.72 15.85,7.01 TP15.P$1
  Bottom 0.152: v12.88,4.72 IC10.3 14.83,4.72 16.74,2.82 17.78,2.82 18.11,2.49 R10.P$2
W_VOLTAGE  (via drill 0.4 pad 0.65)
  Top 0.152: R18.P$2 8.66,19.89 9.2,20.42 12.45,20.42 TP5.P$1 13.87,19 14.76,19 15.61,18.15 C38.P$1 R26.P$1 18.96,18.15 19.37,17.73 U2.7 20.83,17.73 21.31,17.73 v21.39,17.65
  Bottom 0.152: R22.P$1 22.27,17.06 21.98,17.06 v21.39,17.65

### Text on the board
Top: CLOGIC V0.3 | OPEN-BLDC | (C) 2010 J.R. | CC-BY-SA
tPlace: UART | G | 5 | B | R | A | T | 5 | G | CAN | ENC | G | L | H | 5 | JTAG
tStop: CLOGIC V0.2 | OPEN-BLDC | (C) 2010 J.R. | CC-BY-SA